# Altium schematic sheet LOGIC_FPGA.SchDoc: FPGA Logic
size B; Engineer: M. Jones; Organization: Michael Jones; DocumentNumber: 2; Revision: RA.1; SheetNumber: 2; SheetTotal: 7
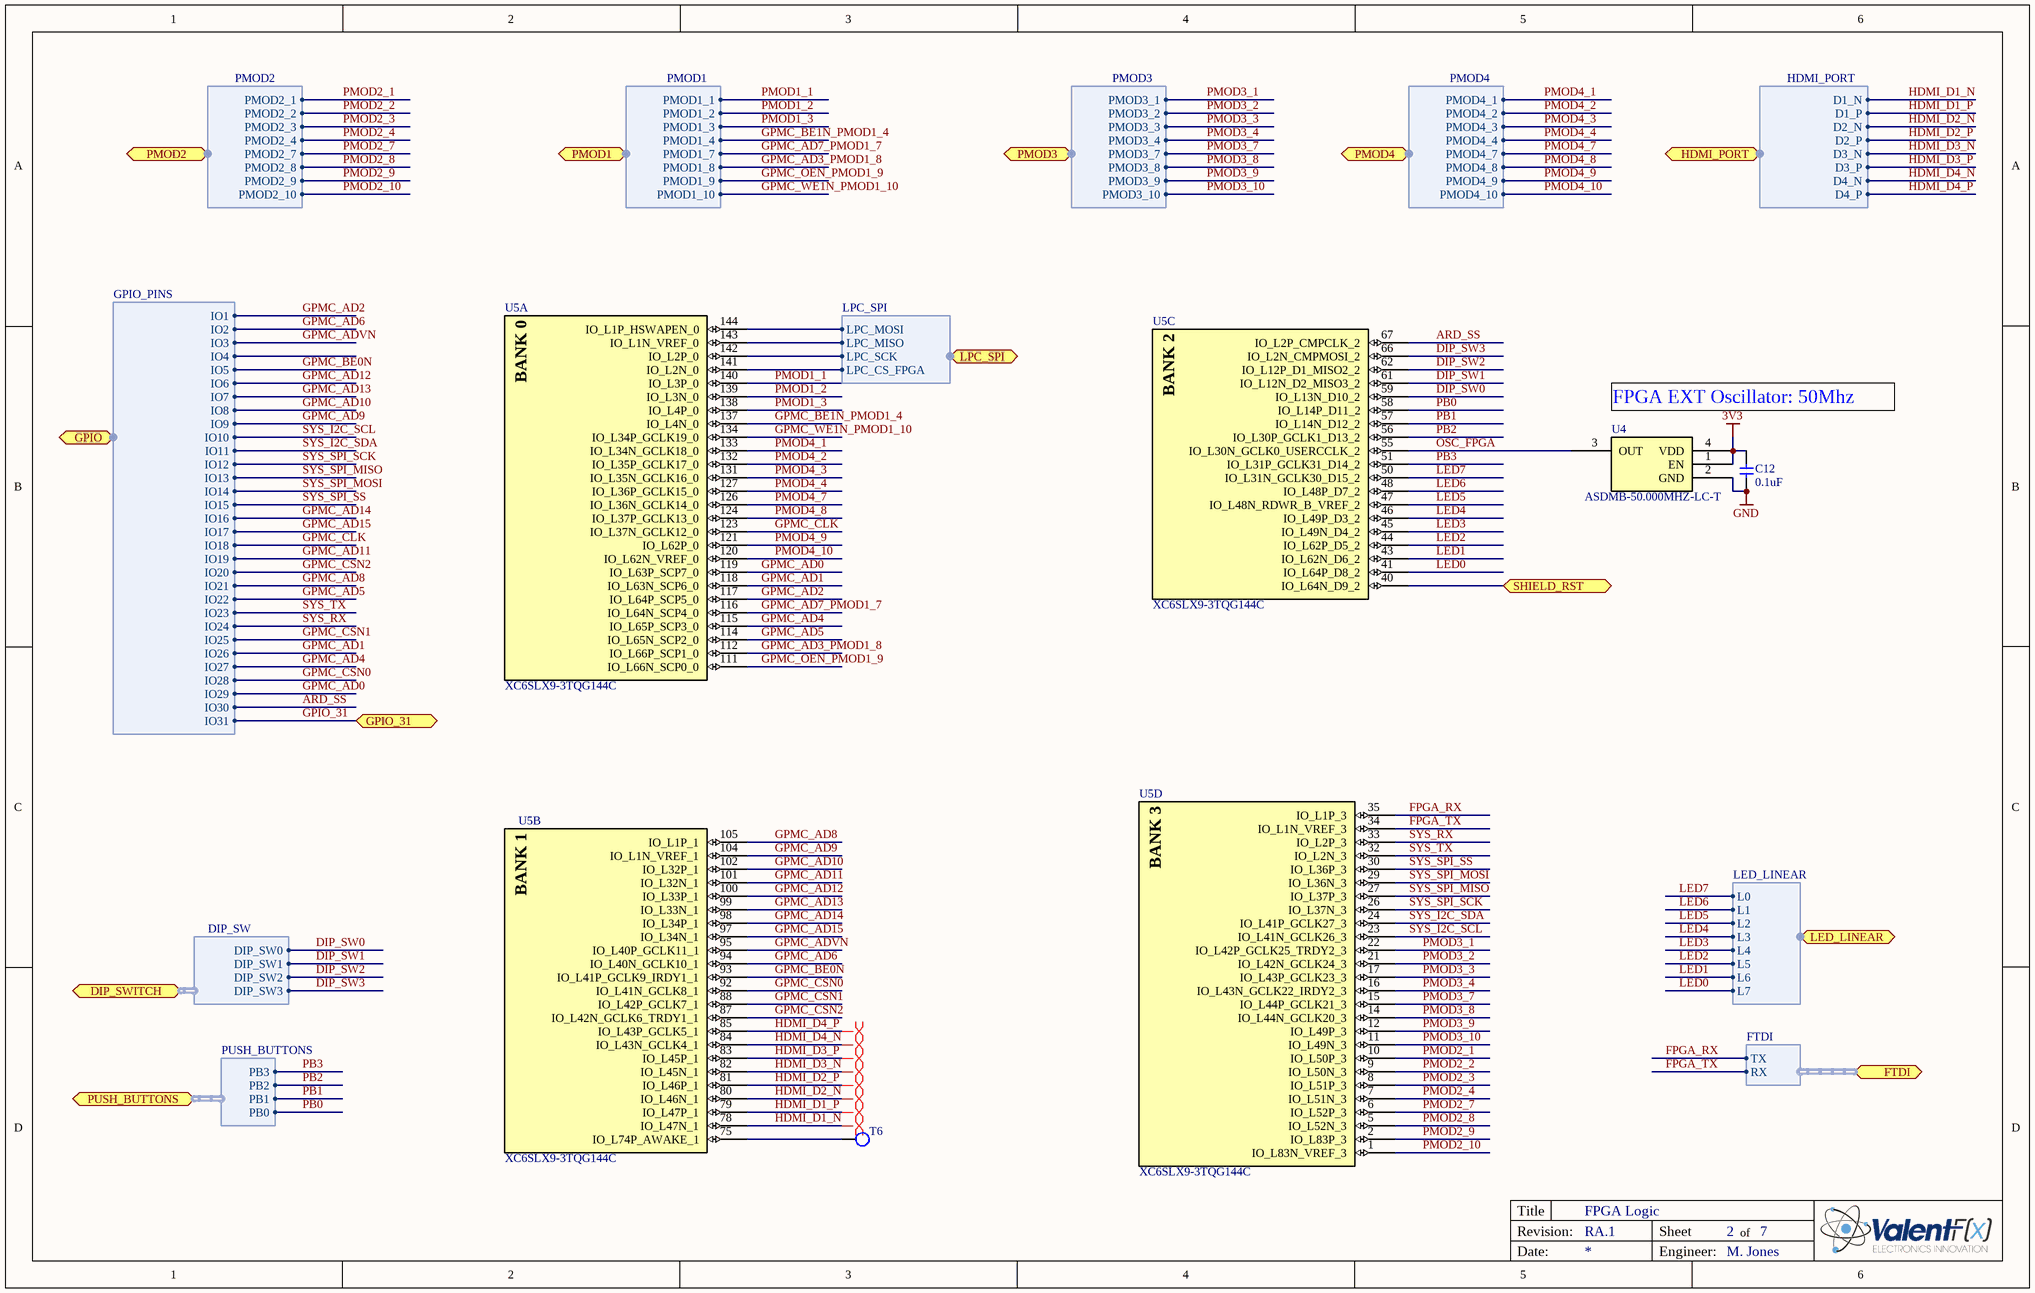
[diagram p0: LOGIC_FPGA.SchDoc]

## Parts
C12  0.1uF  [C0603]
T6  Test Point  [tp 18-28]  (value not drawn)
U4  ASDMB-50.000MHZ-LC-T  [ASDMB - osc]
U5  XC6SLX9-3TQG144C  [TQ144_L]  (parts A,B,C,D of 7)

## Ports
DIP_SWITCH (harness DIP_SW), FTDI (harness FTDI), GPIO (harness GPIO_PINS), GPIO_31, HDMI_PORT (harness HDMI_PORT), LED_LINEAR (harness LED_LINEAR), LPC_SPI (harness LPC_SPI), PMOD1 (harness PMOD1), PMOD2 (harness PMOD2), PMOD3 (harness PMOD3), PMOD4 (harness PMOD4), PUSH_BUTTONS (harness PUSH_BUTTONS), SHIELD_RST

## Harnesses
DIP_SW: DIP_SW0, DIP_SW1, DIP_SW2, DIP_SW3
PUSH_BUTTONS: PB0, PB1, PB2, PB3
LED_LINEAR: L0, L1, L2, L3, L4, L5, L6, L7
PMOD2: PMOD2_1, PMOD2_2, PMOD2_3, PMOD2_4, PMOD2_7, PMOD2_8, PMOD2_9, PMOD2_10
PMOD3: PMOD3_1, PMOD3_2, PMOD3_3, PMOD3_4, PMOD3_7, PMOD3_8, PMOD3_9, PMOD3_10
PMOD4: PMOD4_1, PMOD4_2, PMOD4_3, PMOD4_4, PMOD4_7, PMOD4_8, PMOD4_9, PMOD4_10
FTDI: TX, RX
GPIO_PINS: IO1, IO2, IO3, IO4, IO5, IO6, IO7, IO8, IO9, IO10, IO11, IO12, IO13, IO14, IO15, IO16, IO17, IO18, IO19, IO20, IO21, IO22, IO23, IO24, IO25, IO26, IO27, IO28, IO29, IO30, IO31
HDMI_PORT: D1_P, D1_N, D2_N, D3_N, D4_N, D2_P, D3_P, D4_P
LPC_SPI: LPC_MOSI, LPC_MISO, LPC_SCK, LPC_CS_FPGA
PMOD1: PMOD1_1, PMOD1_2, PMOD1_3, PMOD1_4, PMOD1_7, PMOD1_8, PMOD1_9, PMOD1_10

## Nets
3V3: C12.2 U4.1(EN) U4.4(VDD)
GND: C12.1 U4.2(GND)
ARD_SS: U5.67(IO_L2P_CMPCLK_2) ; port GPIO.IO30
DIP_SW0: U5.59(IO_L13N_D10_2) ; port DIP_SWITCH.DIP_SW0
DIP_SW1: U5.61(IO_L12N_D2_MISO3_2) ; port DIP_SWITCH.DIP_SW1
DIP_SW2: U5.62(IO_L12P_D1_MISO2_2) ; port DIP_SWITCH.DIP_SW2
DIP_SW3: U5.66(IO_L2N_CMPMOSI_2) ; port DIP_SWITCH.DIP_SW3
FPGA_RX: U5.35(IO_L1P_3) ; port FTDI.TX
FPGA_TX: U5.34(IO_L1N_VREF_3) ; port FTDI.RX
GPIO_31: port GPIO_31, port GPIO.IO31
GPMC_AD0: U5.119(IO_L63P_SCP7_0) ; port GPIO.IO29
GPMC_AD1: U5.118(IO_L63N_SCP6_0) ; port GPIO.IO26
GPMC_AD2: U5.117(IO_L64P_SCP5_0) ; port GPIO.IO1
GPMC_AD3_PMOD1_8: U5.112(IO_L66P_SCP1_0) ; port PMOD1.PMOD1_8
GPMC_AD4: U5.115(IO_L65P_SCP3_0) ; port GPIO.IO27
GPMC_AD5: U5.114(IO_L65N_SCP2_0) ; port GPIO.IO22
GPMC_AD6: U5.94(IO_L40N_GCLK10_1) ; port GPIO.IO2
GPMC_AD7_PMOD1_7: U5.116(IO_L64N_SCP4_0) ; port PMOD1.PMOD1_7
GPMC_AD8: U5.105(IO_L1P_1) ; port GPIO.IO21
GPMC_AD9: U5.104(IO_L1N_VREF_1) ; port GPIO.IO9
GPMC_AD10: U5.102(IO_L32P_1) ; port GPIO.IO8
GPMC_AD11: U5.101(IO_L32N_1) ; port GPIO.IO19
GPMC_AD12: U5.100(IO_L33P_1) ; port GPIO.IO6
GPMC_AD13: U5.99(IO_L33N_1) ; port GPIO.IO7
GPMC_AD14: U5.98(IO_L34P_1) ; port GPIO.IO16
GPMC_AD15: U5.97(IO_L34N_1) ; port GPIO.IO17
GPMC_ADVN: U5.95(IO_L40P_GCLK11_1) ; port GPIO.IO3
GPMC_BE0N: U5.93(IO_L41P_GCLK9_IRDY1_1) ; port GPIO.IO5
GPMC_BE1N_PMOD1_4: U5.137(IO_L4N_0) ; port PMOD1.PMOD1_4
GPMC_CLK: U5.123(IO_L37N_GCLK12_0) ; port GPIO.IO18
GPMC_CSN0: U5.92(IO_L41N_GCLK8_1) ; port GPIO.IO28
GPMC_CSN1: U5.88(IO_L42P_GCLK7_1) ; port GPIO.IO25
GPMC_CSN2: U5.87(IO_L42N_GCLK6_TRDY1_1) ; port GPIO.IO20
GPMC_OEN_PMOD1_9: U5.111(IO_L66N_SCP0_0) ; port PMOD1.PMOD1_9
GPMC_WE1N_PMOD1_10: U5.134(IO_L34P_GCLK19_0) ; port PMOD1.PMOD1_10
HDMI_D1_N: U5.78(IO_L47N_1) ; port HDMI_PORT.D1_N
HDMI_D1_P: U5.79(IO_L47P_1) ; port HDMI_PORT.D1_P
HDMI_D2_N: U5.80(IO_L46N_1) ; port HDMI_PORT.D2_N
HDMI_D2_P: U5.81(IO_L46P_1) ; port HDMI_PORT.D2_P
HDMI_D3_N: U5.82(IO_L45N_1) ; port HDMI_PORT.D3_N
HDMI_D3_P: U5.83(IO_L45P_1) ; port HDMI_PORT.D3_P
HDMI_D4_N: U5.84(IO_L43N_GCLK4_1) ; port HDMI_PORT.D4_N
HDMI_D4_P: U5.85(IO_L43P_GCLK5_1) ; port HDMI_PORT.D4_P
LED0: U5.41(IO_L64P_D8_2) ; port LED_LINEAR.L7
LED1: U5.43(IO_L62N_D6_2) ; port LED_LINEAR.L6
LED2: U5.44(IO_L62P_D5_2) ; port LED_LINEAR.L5
LED3: U5.45(IO_L49N_D4_2) ; port LED_LINEAR.L4
LED4: U5.46(IO_L49P_D3_2) ; port LED_LINEAR.L3
LED5: U5.47(IO_L48N_RDWR_B_VREF_2) ; port LED_LINEAR.L2
LED6: U5.48(IO_L48P_D7_2) ; port LED_LINEAR.L1
LED7: U5.50(IO_L31N_GCLK30_D15_2) ; port LED_LINEAR.L0
OSC_FPGA: U4.3(OUT) U5.55(IO_L30N_GCLK0_USERCCLK_2)
PB0: U5.58(IO_L14P_D11_2) ; port PUSH_BUTTONS.PB0
PB1: U5.57(IO_L14N_D12_2) ; port PUSH_BUTTONS.PB1
PB2: U5.56(IO_L30P_GCLK1_D13_2) ; port PUSH_BUTTONS.PB2
PB3: U5.51(IO_L31P_GCLK31_D14_2) ; port PUSH_BUTTONS.PB3
PMOD1_1: U5.140(IO_L3P_0) ; port PMOD1.PMOD1_1
PMOD1_2: U5.139(IO_L3N_0) ; port PMOD1.PMOD1_2
PMOD1_3: U5.138(IO_L4P_0) ; port PMOD1.PMOD1_3
PMOD2_1: U5.10(IO_L50P_3) ; port PMOD2.PMOD2_1
PMOD2_2: U5.9(IO_L50N_3) ; port PMOD2.PMOD2_2
PMOD2_3: U5.8(IO_L51P_3) ; port PMOD2.PMOD2_3
PMOD2_4: U5.7(IO_L51N_3) ; port PMOD2.PMOD2_4
PMOD2_7: U5.6(IO_L52P_3) ; port PMOD2.PMOD2_7
PMOD2_8: U5.5(IO_L52N_3) ; port PMOD2.PMOD2_8
PMOD2_9: U5.2(IO_L83P_3) ; port PMOD2.PMOD2_9
PMOD2_10: U5.1(IO_L83N_VREF_3) ; port PMOD2.PMOD2_10
PMOD3_1: U5.22(IO_L42P_GCLK25_TRDY2_3) ; port PMOD3.PMOD3_1
PMOD3_2: U5.21(IO_L42N_GCLK24_3) ; port PMOD3.PMOD3_2
PMOD3_3: U5.17(IO_L43P_GCLK23_3) ; port PMOD3.PMOD3_3
PMOD3_4: U5.16(IO_L43N_GCLK22_IRDY2_3) ; port PMOD3.PMOD3_4
PMOD3_7: U5.15(IO_L44P_GCLK21_3) ; port PMOD3.PMOD3_7
PMOD3_8: U5.14(IO_L44N_GCLK20_3) ; port PMOD3.PMOD3_8
PMOD3_9: U5.12(IO_L49P_3) ; port PMOD3.PMOD3_9
PMOD3_10: U5.11(IO_L49N_3) ; port PMOD3.PMOD3_10
PMOD4_1: U5.133(IO_L34N_GCLK18_0) ; port PMOD4.PMOD4_1
PMOD4_2: U5.132(IO_L35P_GCLK17_0) ; port PMOD4.PMOD4_2
PMOD4_3: U5.131(IO_L35N_GCLK16_0) ; port PMOD4.PMOD4_3
PMOD4_4: U5.127(IO_L36P_GCLK15_0) ; port PMOD4.PMOD4_4
PMOD4_7: U5.126(IO_L36N_GCLK14_0) ; port PMOD4.PMOD4_7
PMOD4_8: U5.124(IO_L37P_GCLK13_0) ; port PMOD4.PMOD4_8
PMOD4_9: U5.121(IO_L62P_0) ; port PMOD4.PMOD4_9
PMOD4_10: U5.120(IO_L62N_VREF_0) ; port PMOD4.PMOD4_10
SHIELD_RST: U5.40(IO_L64N_D9_2) ; port SHIELD_RST
SYS_I2C_SCL: U5.23(IO_L41N_GCLK26_3) ; port GPIO.IO10
SYS_I2C_SDA: U5.24(IO_L41P_GCLK27_3) ; port GPIO.IO11
SYS_RX: U5.33(IO_L2P_3) ; port GPIO.IO24
SYS_SPI_MISO: U5.27(IO_L37P_3) ; port GPIO.IO13
SYS_SPI_MOSI: U5.29(IO_L36N_3) ; port GPIO.IO14
SYS_SPI_SCK: U5.26(IO_L37N_3) ; port GPIO.IO12
SYS_SPI_SS: U5.30(IO_L36P_3) ; port GPIO.IO15
SYS_TX: U5.32(IO_L2N_3) ; port GPIO.IO23
NetT6_1: T6.1 U5.75(IO_L74P_AWAKE_1)
NetU5_141: U5.141(IO_L2N_0) ; port LPC_SPI.LPC_CS_FPGA
NetU5_142: U5.142(IO_L2P_0) ; port LPC_SPI.LPC_SCK
NetU5_143: U5.143(IO_L1N_VREF_0) ; port LPC_SPI.LPC_MISO
NetU5_144: U5.144(IO_L1P_HSWAPEN_0) ; port LPC_SPI.LPC_MOSI

## Layout directives
differential pair: HDMI_D1_N, HDMI_D1_P, HDMI_D2_N, HDMI_D2_P, HDMI_D3_N, HDMI_D3_P, HDMI_D4_N, HDMI_D4_P

## Notes on the sheet
- FPGA EXT Oscillator: 50Mhz
- Title
- Revision:
- Sheet
- of
- Date:
- Engineer:
- (in symbol XC6SLX9-3TQG144C, part A) BANK 0
- (in symbol XC6SLX9-3TQG144C, part B) BANK 1
- (in symbol XC6SLX9-3TQG144C, part C) BANK 2
- (in symbol XC6SLX9-3TQG144C, part D) BANK 3

## Library data of the parts
C12 = GRM188R71H104KA93D: CAP CER .1UF 50V 10% X7R 0603; Manufacturer: Murata Electronics North America; Capacitance: 0.1µF; Manufacturer Part Number: GRM188R71H104KA93D; Value: CAP CER .1UF 50V 10% X7R 0603; Supplier 1: Digi-Key; Supplier Part Number 1: 490-1519-1-ND; RoHS: RoHS Compliant; Category: Capacitors; Stock 1: 9370695; Pricing 1: 10=0.037, 100=0.0221, 500=0.01276, 1000=0.00884 (USD); Voltage - Rated: 50V; Tolerance: ±10%; Temperature Coefficient: X7R; Mounting Type: Surface Mount, MLCC; Operating Temperature: -55°C ~ 125°C; Features: -; Applications: General Purpose; Ratings: -; Package / Case: 0603 (1608 Metric); Size / Dimension: 0.063" L x 0.031" W (1.60mm x 0.80mm); Lead Spacing: -; Thickness: 0.80mm; Packaging: Cut Tape (CT); Lead Style: -; ComponentLink1URL: http://search.murata.co.jp/Ceramy/image/img/PDF/ENG/GRM188R71H104KA93.pdf; ComponentLink1Description: http://search.murata.co.jp/Ceramy/image/img/PDF/ENG/GRM188R71H104KA93.pdf
T6 = Test Point 2: Test Point Smaller Symbol
U4 = ASDMB-50.000MHZ-LC-T: OSC MEMS 50.000 MHZ SMD; Manufacturer: Abracon Corporation; Frequency: 50MHz; Function: Tri-State (Output Enable); Output: CMOS; Voltage - Supply: 1.8 V ~ 3.3 V; Frequency Stability: ±50ppm; Current - Supply (Max): 16mA; Current - Supply (Disable) (Max): 15µA; Supplier 1: Digi-Key; Manufacturer Part Number: ASDMB-50.000MHZ-LC-T; RoHS: RoHS Compliant; Category: Crystals and Oscillators; Stock 1: 967; Pricing 1: 1=1.69, 10=1.463, 50=1.2826, 100=1.0125, 500=0.855 (USD); Type: MEMS (Silicon); Operating Temperature: -40°C ~ 85°C; Mounting Type: Surface Mount; Size / Dimension: 0.098" L x 0.079" W (2.50mm x 2.00mm); Height: 0.035" (0.90mm); Package / Case: 4-SMD, No Lead (DFN, LCC); Packaging: Cut Tape (CT); ComponentLink1URL: http://www.abracon.com/Oscillators/ASDMB.pdf; ComponentLink1Description: http://www.abracon.com/Oscillators/ASDMB.pdf; Supplier Part Number 1: 535-11738-1-ND; Value: ASDMB-50.000MHZ-LC-T
U5 = XC6SLX9-3TQG144C: IC FPAG SPARTAN 6 9K 144TQFP; Manufacturer: Xilinx Inc; Number of Logic Elements/Cells: 9152; Number of LABs/CLBs: 715; Total RAM Bits: 589824; Number of I /O: 102; Voltage - Supply: 1.14 V ~ 1.26 V; Supplier 1: Digi-Key; Supplier Part Number 1: 122-1747-ND; Manufacturer Part Number: XC6SLX9-3TQG144C; RoHS: RoHS Compliant; Category: Integrated Circuits (ICs); Stock 1: 77; Pricing 1: 1=17.22 (USD); Number of Gates: -; Mounting Type: Surface Mount; Operating Temperature: 0°C ~ 85°C; Package / Case: 144-LQFP; Supplier Device Package: 144-TQFP (20x20); ComponentLink1URL: http://www.xilinx.com/support/documentation/data_sheets/ds160.pdf; ComponentLink1Description: http://www.xilinx.com/support/documentation/data_sheets/ds160.pdf; Value: XC6SLX9-3TQG144C